# EasyEDA schematic LG G6 controller_2021-01-08.json
TITLE: Sheet_1; REV: 1.0; Date: 2020-09-12; Sheet: 1/1; Drawn By: danielngiengi; Company: Your Company
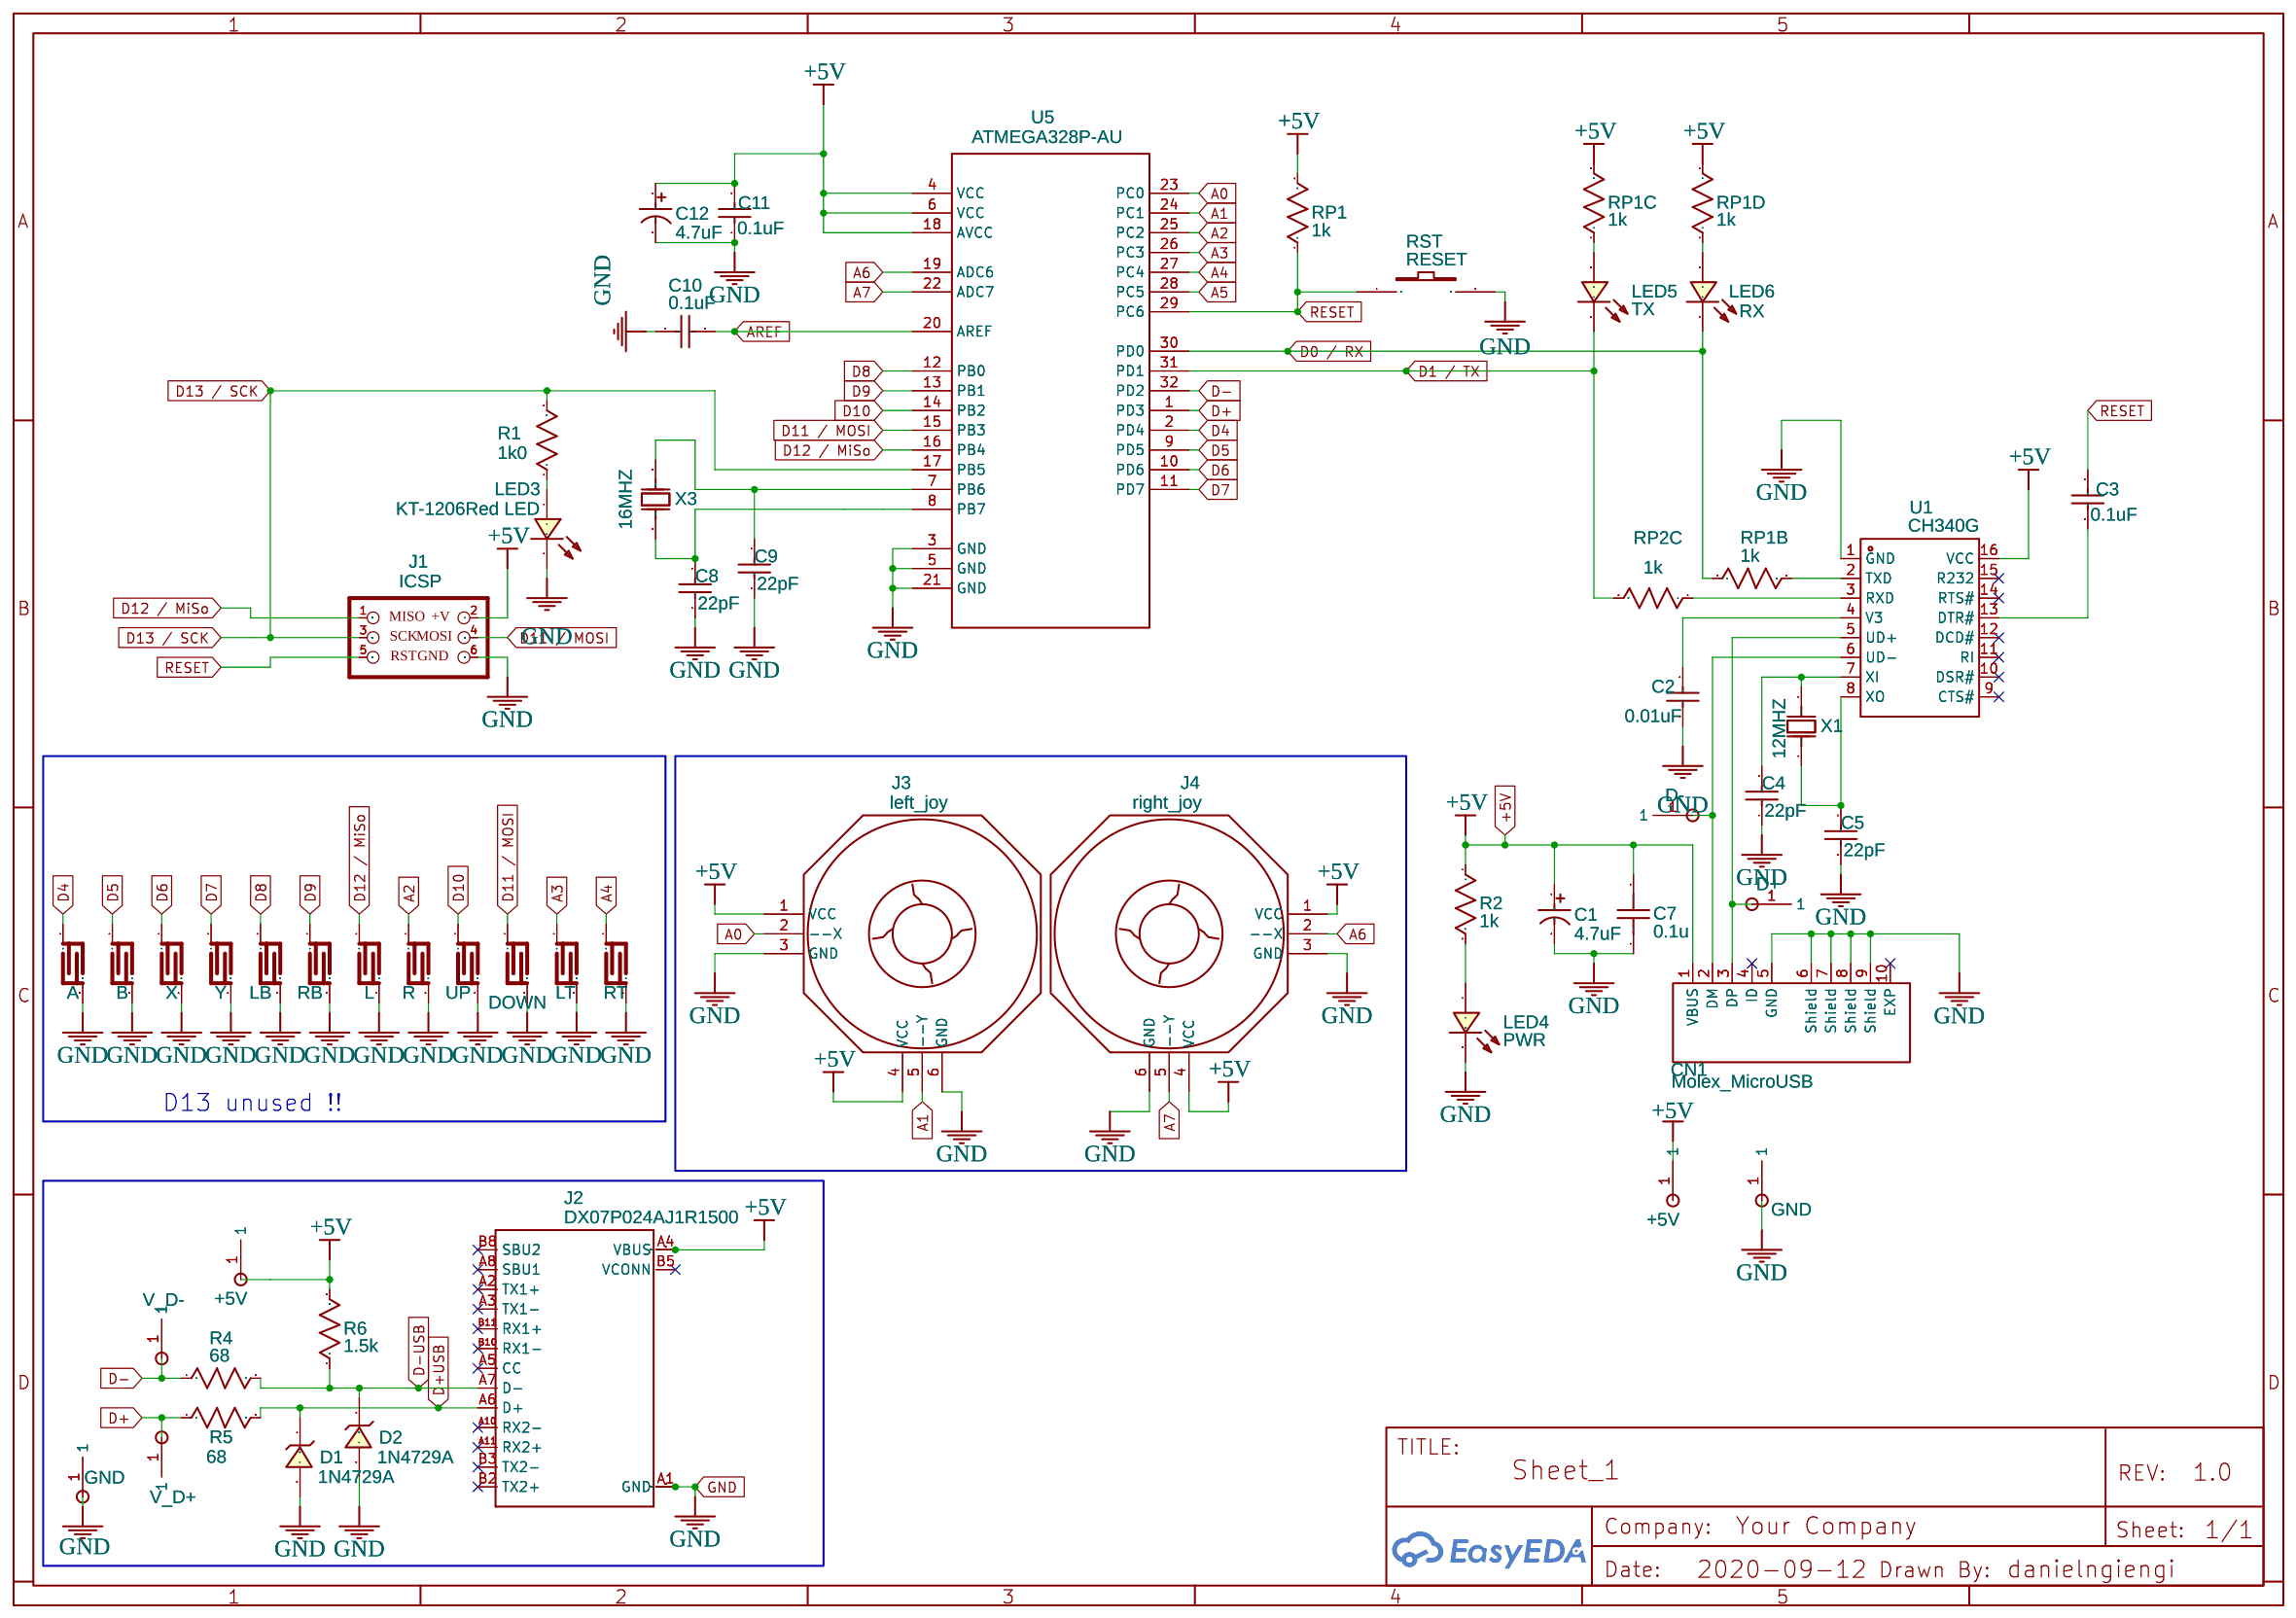
[diagram p0: schematic sheet]

## Parts
C1  4.7uF  [CAP-TH_BD4.0-P1.50-D0.8-FD]
C2  0.01uF  [1206]
C3  0.1uF  [1206]
C4  22pF  [1206]
C5  22pF  [1206]
C7  0.1u  [C1206]
C8  22pF  [1206]
C9  22pF  [1206]
C10  0.1uF  [1206]
C11  0.1uF  [1206]
C12  4.7uF  [CAP-TH_BD4.0-P1.50-D0.8-FD]
CN1  Molex_MicroUSB  [MICRO-USB-475900001]
D1  1N4729A  [DO-41_BD2.4-L4.7-P8.70-D0.9-RD]
D2  1N4729A  [DO-41_BD2.4-L4.7-P8.70-D0.9-RD]
J1  ICSP  [HEADER_PRG_2X03]
J2  DX07P024AJ1R1500  [JAE_DX07P024AJ1R1500]
J3  left_joy  [PSP-JOYSTICK-90]
J4  right_joy  [PSP-JOYSTICK-90]
LED3  KT-1206Red LED  [LED1206-R-RD]
LED4  PWR  [LED1206-R-RD]
LED5  TX  [LED1206-R-RD]
LED6  RX  [LED1206-R-RD]
R1  1k0  [R1206]
R2  1k  [R1206]
R4  68  [R1206]
R5  68  [R1206]
R6  1.5k  [R1206]
RP1  1k  [R1206]
RP1B  1k  [R1206]
RP1C  1k  [R1206]
RP1D  1k  [R1206]
RP2C  1k  [R1206]
RST  RESET  [KEY-6.0*6.0-4]
S1  B  [CARBON-KEY-OBA V1]
S3  X  [CARBON-KEY-OBA V1]
S4  Y  [CARBON-KEY-OBA V1]
S5  A  [CARBON-KEY-OBA V1]
S6  LB  [CARBON-KEY-OBA V1]
S7  RB  [CARBON-KEY-OBA V1]
S8  L  [CARBON-KEY-OBA V1]
S9  R  [CARBON-KEY-OBA V1]
S10  UP  [CARBON-KEY-OBA V1]
S11  DOWN  [CARBON-KEY-OBA V1]
S12  LT  [CARBON-KEY-OBA V1]
S13  RT  [CARBON-KEY-OBA V1]
U1  CH340G  [SOIC-16_L9.9-W3.9-P1.27-LS6.0-BR]
U2  +5V  [PIN]
U3  D-  [PIN]
U4  D+  [PIN]
U5  ATMEGA328P-AU  [TQFP-32_7X7X08P]
U6  GND  [PIN]
U7  +5V  [PIN]
U8  V_D-  [PIN]
U9  V_D+  [PIN]
U10  GND  [PIN]
X1  12MHZ  [HC-49S_L11.0-W4.6-P4.88]
X3  16MHZ  [HC-49S_L11.0-W4.6-P4.88]

## Library data of the parts
C1 C12 = 10uF 25V 4*5: Supplier: LCSC; Manufacturer: ValuePro; Supplier Part: C43846
C2-C5 C8-C11 = C1206X224K251T 3K: Supplier: LCSC; Manufacturer: HEC; Supplier Part: C106050
C7 = Cap_RAD-0.1_US: Manufacturer Part: ?; Package Display: No
CN1 = Molex_MicroUSB: Supplier: Digi-Key; Manufacturer: Molex, LLC; Manufacturer Part: 0475900001; Supplier Part: WM17144CT-ND; Supplier Link: https://www.digikey.kr/product-detail/ko/molex-llc/0475900001/WM17144CT-ND/1832256; Package Display: No
D1 D2 = 1N4729A: Supplier: LCSC; Manufacturer: SEMTECH; Supplier Part: C2532
J1 = -: Contributor: DangerousPrototype; Manufacturer Part: ?
J2 = DX07P024AJ1R1500: Contributor: IBE_Acc
J3 J4 = PSP-JoyStick-90: Contributor: bat869cube672
LED3-LED6 = KT-1206Red LED: Supplier: LCSC; Manufacturer: KENTO; image: //image.lceda.cn/szlcsc/C49018.jpg; Supplier Part: C49018; SMT Type: Extend; JLCPCB SMD: Yes
R1 R2 R4-R6 RP1 RP1B RP1C RP1D RP2C = Res_AXIAL-0.3(1/8W)_US: Manufacturer Part: ?; Package Display: No
RST = -: Supplier Part: C79156; Supplier: LCSC; Manufacturer: PANASONIC; Manufacturer Part: EVQ22705R; Contributor: LCSC
S1 S3-S13 = CARBON-KEY-OBA: sourceId: cwIGEZzVT; Package Display: No
U1 = CH340G: Supplier: LCSC; Manufacturer: WCH; image: //image.lceda.cn/szlcsc/C14267.jpg; Supplier Part: C14267; SMT Type: Basic; JLCPCB SMD: Yes
U2-U4 U6-U10 = Pin: Manufacturer Part: pin pad; Contributor: Titire Dennis
U5 = -: Supplier: LCSC; Manufacturer: MICROCHIP; image: //image.lceda.cn/szlcsc/C14877.jpg; Contributor: LCSC; Supplier Part: C14877
X1 X3 = 49SAC16000202060: Supplier: LCSC; Supplier Part: C390745; Manufacturer: JGHC; Contributor: LCSC

## Nets
+5V: C1.1 C7.2 C11.2 C12.1 CN1.1(VBUS) J1.2(+V) J2.A4(VBUS) J2.A9(VBUS) J2.B4(VBUS) J2.B9(VBUS) J3.1(VCC) J3.4(VCC) J4.1(VCC) J4.4(VCC) R2.1 R6.2 RP1.2 RP1C.2 RP1D.2 U1.16(VCC) U2.1 U5.4(VCC) U5.6(VCC) U5.18(AVCC) U7.1
GND: C1.2 C2.1 C4.1 C5.1 C7.1 C8.1 C9.1 C10.2 C11.1 C12.2 CN1.5(GND) CN1.6(Shield) CN1.7(Shield) CN1.8(Shield) CN1.9(Shield) D1.2(A) D2.2(A) J1.6(GND) J2.A1(GND) J2.A12(GND) J2.B1(GND) J2.B12(GND) J3.3(GND) J3.6(GND) J4.3(GND) J4.6(GND) LED3.2(K) LED4.2(K) RST.2 S1.2 S3.2 S4.2 S5.2 S6.2 S7.2 S8.2 S9.2 S10.2 S11.2 S12.2 S13.2 U1.1(GND) U5.3(GND) U5.5(GND) U5.21(GND) U6.1 U10.1
A0: J3.2(--X) U5.23(PC0)
A1: J3.5(--Y) U5.24(PC1)
A2: S9.1 U5.25(PC2)
A3: S12.1 U5.26(PC3)
A4: S13.1 U5.27(PC4)
A5: U5.28(PC5)
A6: J4.2(--X) U5.19(ADC6)
A7: J4.5(--Y) U5.22(ADC7)
AREF: C10.1 U5.20(AREF)
D0 / RX: LED6.2(K) RP1B.1 U5.30(PD0)
D1 / TX: LED5.2(K) RP2C.2 U5.31(PD1)
D4: S5.1 U5.2(PD4)
D5: S1.1 U5.9(PD5)
D6: S3.1 U5.10(PD6)
D7: S4.1 U5.11(PD7)
D8: S6.1 U5.12(PB0)
D9: S7.1 U5.13(PB1)
D10: S10.1 U5.14(PB2)
D11 / MOSI: J1.4(MOSI) S11.1 U5.15(PB3)
D12 / MiSo: J1.1(MISO) S8.1 U5.16(PB4)
D13 / SCK: J1.3(SCK) R1.2 U5.17(PB5)
D+: R5.1 U5.1(PD3) U9.1
D+USB: D1.1(C) J2.A6(D+) R5.2
D-: R4.1 U5.32(PD2) U8.1
D-USB: D2.1(C) J2.A7(D-) R4.2 R6.1
RESET: C3.2 J1.5(RST) RP1.1 RST.1 U5.29(PC6)
Net-(C2-2): C2.2 U1.4(V3)
Net-(C3-1): C3.1 U1.13(DTR#)
Net-(C4-2): C4.2 U1.7(XI) X1.2(OSC2)
Net-(C5-2): C5.2 U1.8(XO) X1.1(OSC1)
Net-(C8-2): C8.2 U5.8(PB7) X3.1(OSC1)
Net-(C9-2): C9.2 U5.7(PB6) X3.2(OSC2)
Net-(CN1-2): CN1.2(DM) U1.6(UD-) U3.1
Net-(CN1-3): CN1.3(DP) U1.5(UD+) U4.1
Net-(LED3-1): LED3.1(A) R1.1
Net-(LED4-1): LED4.1(A) R2.2
Net-(LED5-1): LED5.1(A) RP1C.1
Net-(LED6-1): LED6.1(A) RP1D.1
Net-(RP1B-2): RP1B.2 U1.2(TXD)
Net-(RP2C-1): RP2C.1 U1.3(RXD)

Not connected (* = marked no-connect by the designer): CN1 4(ID)* 10(EXP)*; J2 A2(TX1+)* A3(TX1-)* A5(CC)* A8(SBU1)* A10(RX2-)* A11(RX2+)* B2(TX2+)* B3(TX2-)* B5(VCONN)* B8(SBU2)* B10(RX1-)* B11(RX1+)*; U1 9(CTS#)* 10(DSR#)* 11(RI)* 12(DCD#)* 14(RTS#)* 15(R232)*

## Notes on the sheet
- D13 unused !!
